# Altium project esp32_lcd.PrjPcb
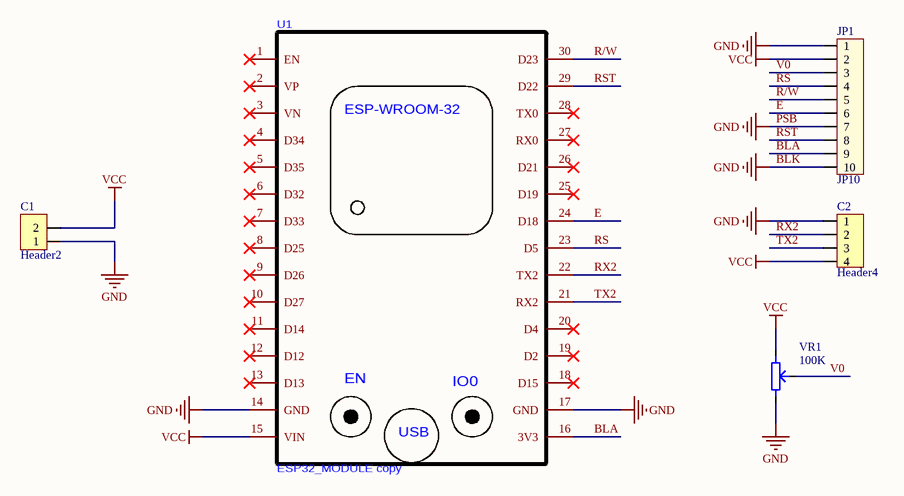
[diagram p0: Sheet1.SchDoc]
1 sheet, 5 parts. Net scope: global (net labels, ports and power ports of the same name join across sheets).
Board file: PCB1.PcbDoc

## Sheet Sheet1.SchDoc
size A3; SheetNumber: 1; SheetTotal: 1

### Parts
C1  Header2  [Header2]
C2  Header4  [Header4]
JP1  JP10  [Header10]
U1  ESP32_MODULE copy  [ESP32-WIFIMODULE-FOOTPRINT]
VR1  100K  [Bien Tro Tam Giac Dung]

### Nets
BLK: C1.1 C2.1 JP1.1 JP1.7 JP1.10 U1.14(GND) U1.17(GND) VR1.3  [also labelled GND, PSB]
VCC: C1.2 C2.4 JP1.2 U1.15(VIN) VR1.1
BLA: JP1.9 U1.16(3V3)
E: JP1.6 U1.24(D18)
R/W: JP1.5 U1.30(D23)
RS: JP1.4 U1.23(D5)
RST: JP1.8 U1.29(D22)
RX2: C2.2 U1.22(TX2)
TX2: C2.3 U1.21(RX2)
V0: JP1.3 VR1.2

Not connected (* = marked no-connect by the designer): U1 1(EN)* 2(VP)* 3(VN)* 4(D34)* 5(D35)* 6(D32)* 7(D33)* 8(D25)* 9(D26)* 10(D27)* 11(D14)* 12(D12)* 13(D13)* 18(D15)* 19(D2)* 20(D4)* 25(D19)* 26(D21)* 27(RX0)* 28(TX0)*

### Notes on the sheet
- (in symbol ESP32_MODULE copy) ESP-WROOM-32; IO0; USB

### Library data of the parts
C1 = Header2: Header IDC, 2 x 1 Pin Vertical 2.54mm Pitch (Non-Boxed, Male); Manufacturer: W¨¹rth Elektronik eiSos GmbH; partNo: 613002143121; ComponentLink1 Description: Manufacturer; ComponentLink2 Description: Datasheet; NoPins: 02; Created Date: 29 March 2013; ComponentLink1URL: http://www.we-online.com; ComponentLink2URL: http://katalog.we-online.de/em/datasheet/6130xx143121.pdf; Created by: Karrer Zheng
C2 = Header4: Header IDC, 4 x 1 Pin Vertical 2.54mm Pitch (Non-Boxed, Male); Manufacturer: W¨¹rth Elektronik eiSos GmbH; partNo: 613002143121; ComponentLink1 Description: Manufacturer; ComponentLink2 Description: Datasheet; NoPins: 02; Created Date: 29 March 2013; ComponentLink1URL: http://www.we-online.com; ComponentLink2URL: http://katalog.we-online.de/em/datasheet/6130xx143121.pdf; Created by: Karrer Zheng
JP1 = Header10: Connector 10; Value: Connector 10
VR1 = Bien tro tam giac 100K Dung: Cắm; Don_Vi: Con; Ten_Linh_Kien: Biến Trở Tam Giác 104-100K RM065; Ma_Hang: MH003711; Chung_Loai: Cắm; Ghi_Chu: *; Kieu_Chan: *